# Altium schematic sheet Sheet1.SchDoc
size A4
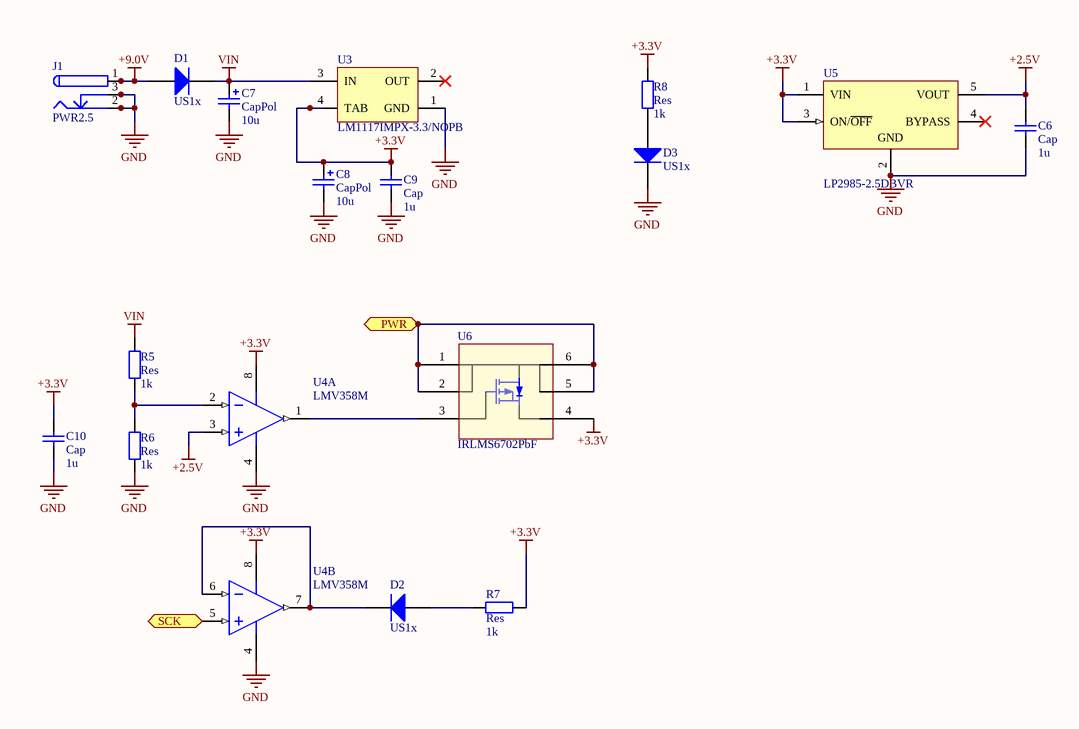
[diagram p0: Sheet1.SchDoc]

## Parts
C6  Cap  value 1u  [0805]
C7  CapPol  value 10u  [CASE C]
C8  CapPol  value 10u  [CASE C]
C9  Cap  value 1u  [0805]
C10  Cap  value 1u  [0805]
D1  US1x  [D0-214AC (SMA)]
D2  US1x  [D0-214AC (SMA)]
D3  US1x  [D0-214AC (SMA)]
J1  PWR2.5  [KLD-0202]
R5  Res  value 1k  [0805]
R6  Res  value 1k  [0805]
R7  Res  value 1k  [0805]
R8  Res  value 1k  [0805]
U3  LM1117IMPX-3.3/NOPB  [MP04A_N]
U4  LMV358M  [M08A_N]  (parts A,B of 2)
U5  LP2985-2.5DBVR  [TI-DBV5_N]
U6  IRLMS6702PbF  [SuperSOT-6]

## Ports
PWR, SCK

## Nets
+2.5V: C6.2 U4.3(INA+) U5.5(VOUT)
+3.3V: C8.1 C9.2 C10.2 R7.1 R8.1 U3.4(TAB) U4.8(V+) U5.1(VIN) U5.3(ON/~{OFF}) U6.4(S)
+9.0V: D1.1(A) J1.1 J1.1A
GND: C6.1 C7.2 C8.2 C9.1 C10.1 D3.2(K) J1.2 J1.2A J1.3 J1.3A R6.1 U3.1(GND) U4.4(V-) U5.2(GND)
VIN: C7.1 D1.2(K) R5.2 U3.3(IN)
PWR: U6.1(D) U6.2(D) U6.5(D) U6.6(D) ; port PWR
SCK: U4.5(INB+) ; port SCK
NetD2_1: D2.1(A) R7.2
NetD2_2: D2.2(K) U4.6(INB-) U4.7(OUTB)
NetD3_1: D3.1(A) R8.2
NetR5_1: R5.1 R6.2 U4.2(INA-)
NetU4_1: U4.1(OUTA) U6.3(G)

Not connected (* = marked no-connect by the designer): U3 2(OUT)*; U5 4(BYPASS)*

## Library data of the parts
C7 C8 = CapPol: Polarized Capacitor (Radial)
D1-D3 = US1x: Ultrafast Rectifier
J1 = PWR2.5: Low Voltage Power Supply Connector
U3 = LM1117IMPX-3.3/NOPB: 800mA Low-Dropout Linear Regulator, 4-pin SOT-223, Pb-Free; Manufacturer: National Semiconductor; PackageTopMarking: XYTT*N05B; PowerWise: N; CompType: LDO IC; High-Reliability: Y; DatasheetVersion: Apr-2006; PackageVersion: revB, Apr-2003; PackageReference: MP04A; PackageDescription: Molded SOT-223, 6.50 x 3.56 x 1.6mm Body, 4 Lead, 2.3mm Pitch; PartNumber: LM1117IMPX-3.3/NOPB; RoHS: Y; PinCount: 4; Code_JEDEC: TO-261-AA; Code_IPC: SOT223-4; ComponentLink1Description: Manufacturer URL; ComponentLink1URL: http://www.national.com/; ComponentLink2Description: LM1117 Datasheet; ComponentLink2URL: http://www.national.com/ds/LM/LM1117.pdf; ComponentLink3Description: LM1117 Web Page; ComponentLink3URL: http://www.national.com/pf/LM/LM1117.html; ComponentLink4Description: MP04A Package Page; ComponentLink4URL: http://www.national.com/packaging/folders/mp04a.html
U4 = LMV358M: General Purpose, Low Voltage, Rail-to-Rail Output Operational Amplifiers, 8-pin Narrow SOIC; Manufacturer: National Semiconductor; PackageTopMarking: NSZXTT*LMV*358M; PowerWise: N; High-Reliability: Y; DatasheetVersion: Sep-2009; PackageVersion: revM, May-2009; PackageReference: M08A; PackageDescription: SOIC Narrow, 4.9 x 3.9 x 1.45mm, 8 Lead, 1.27mm Pitch; PartNumber: LMV358M; RoHS: N; PinCount: 8; CompType: Amplifiers; Code_JEDEC: MS-012-AA; Code_IPC: SOIC127P600-8; ComponentLink1Description: Manufacturer URL; ComponentLink1URL: http://www.national.com/; ComponentLink2Description: LMV358 Datasheet; ComponentLink2URL: http://www.national.com/ds/LM/LMV358.pdf; ComponentLink3Description: LMV358 Web Page; ComponentLink3URL: http://www.national.com/pf/LM/LMV358.html; ComponentLink4Description: M08A Package Page; ComponentLink4URL: http://www.national.com/packaging/folders/m08a.html
U5 = LP2985-10DBVR: Single Output Low Noise LDO, 150 mA, Fixed 10 V Output, 2.2 to 16 V Input, with Low IQ, 5-pin SOT-23 (DBV), -40 to 125 degC, Green (RoHS & no Sb/Br); Manufacturer: Texas Instruments; Accuracy(%): 1.5; Fixed Output Options(V): 10; Iout(Max)(A): 0.15; Iq(Typ)(mA): 0.85; SubFamily: Single Channel LDO; Vdo(Typ)(mV): 280; Vin(Max)(V): 16; Vin(Min)(V): 2.2; DatasheetVersion: SLVS522N; PackageVersion: 4073253-4/K; PackageReference: DBV5; PackageDescription: 5-Pin Plastic Small Outline, Body 1.60 Г— 2.90 mm, Pitch 0.95 mm; Supplier 1: Digi-Key; Supplier Part Number 1: 296-24263-2-ND; Supplier 2: Digi-Key; Supplier Part Number 2: 296-24263-1-ND; Supplier 3: Digi-Key; Supplier Part Number 3: 296-24263-6-ND; Supplier 4: Newark; Supplier Part Number 4: 24R9588; Supplier 5: Mouser; Supplier Part Number 5: 595-LP2985-10DBVR; Eco-Plan: Green (RoHS & no Sb/Br); Vout Adj(Max)(V): 10; Vout Adj(Min)(V): 10; Mounting Technology: Surface Mount; Code_JEDEC: MO-178; PartNumber: LP2985-10DBVR; ComponentLink1Description: Manufacturer URL; ComponentLink1URL: http://www.ti.com/; ComponentLink2Description: Datasheet; ComponentLink2URL: http://www.ti.com/general/docs/lit/getliterature.tsp?genericPartNumber=LP2985-10&fileType=pdf; ComponentLink3Description: Package Specification; ComponentLink3URL: http://www.ti.com/litv/pdf/mpds018i